# EAGLE schematic hoekdrive23-test-fixture (EAGLE 5.12)
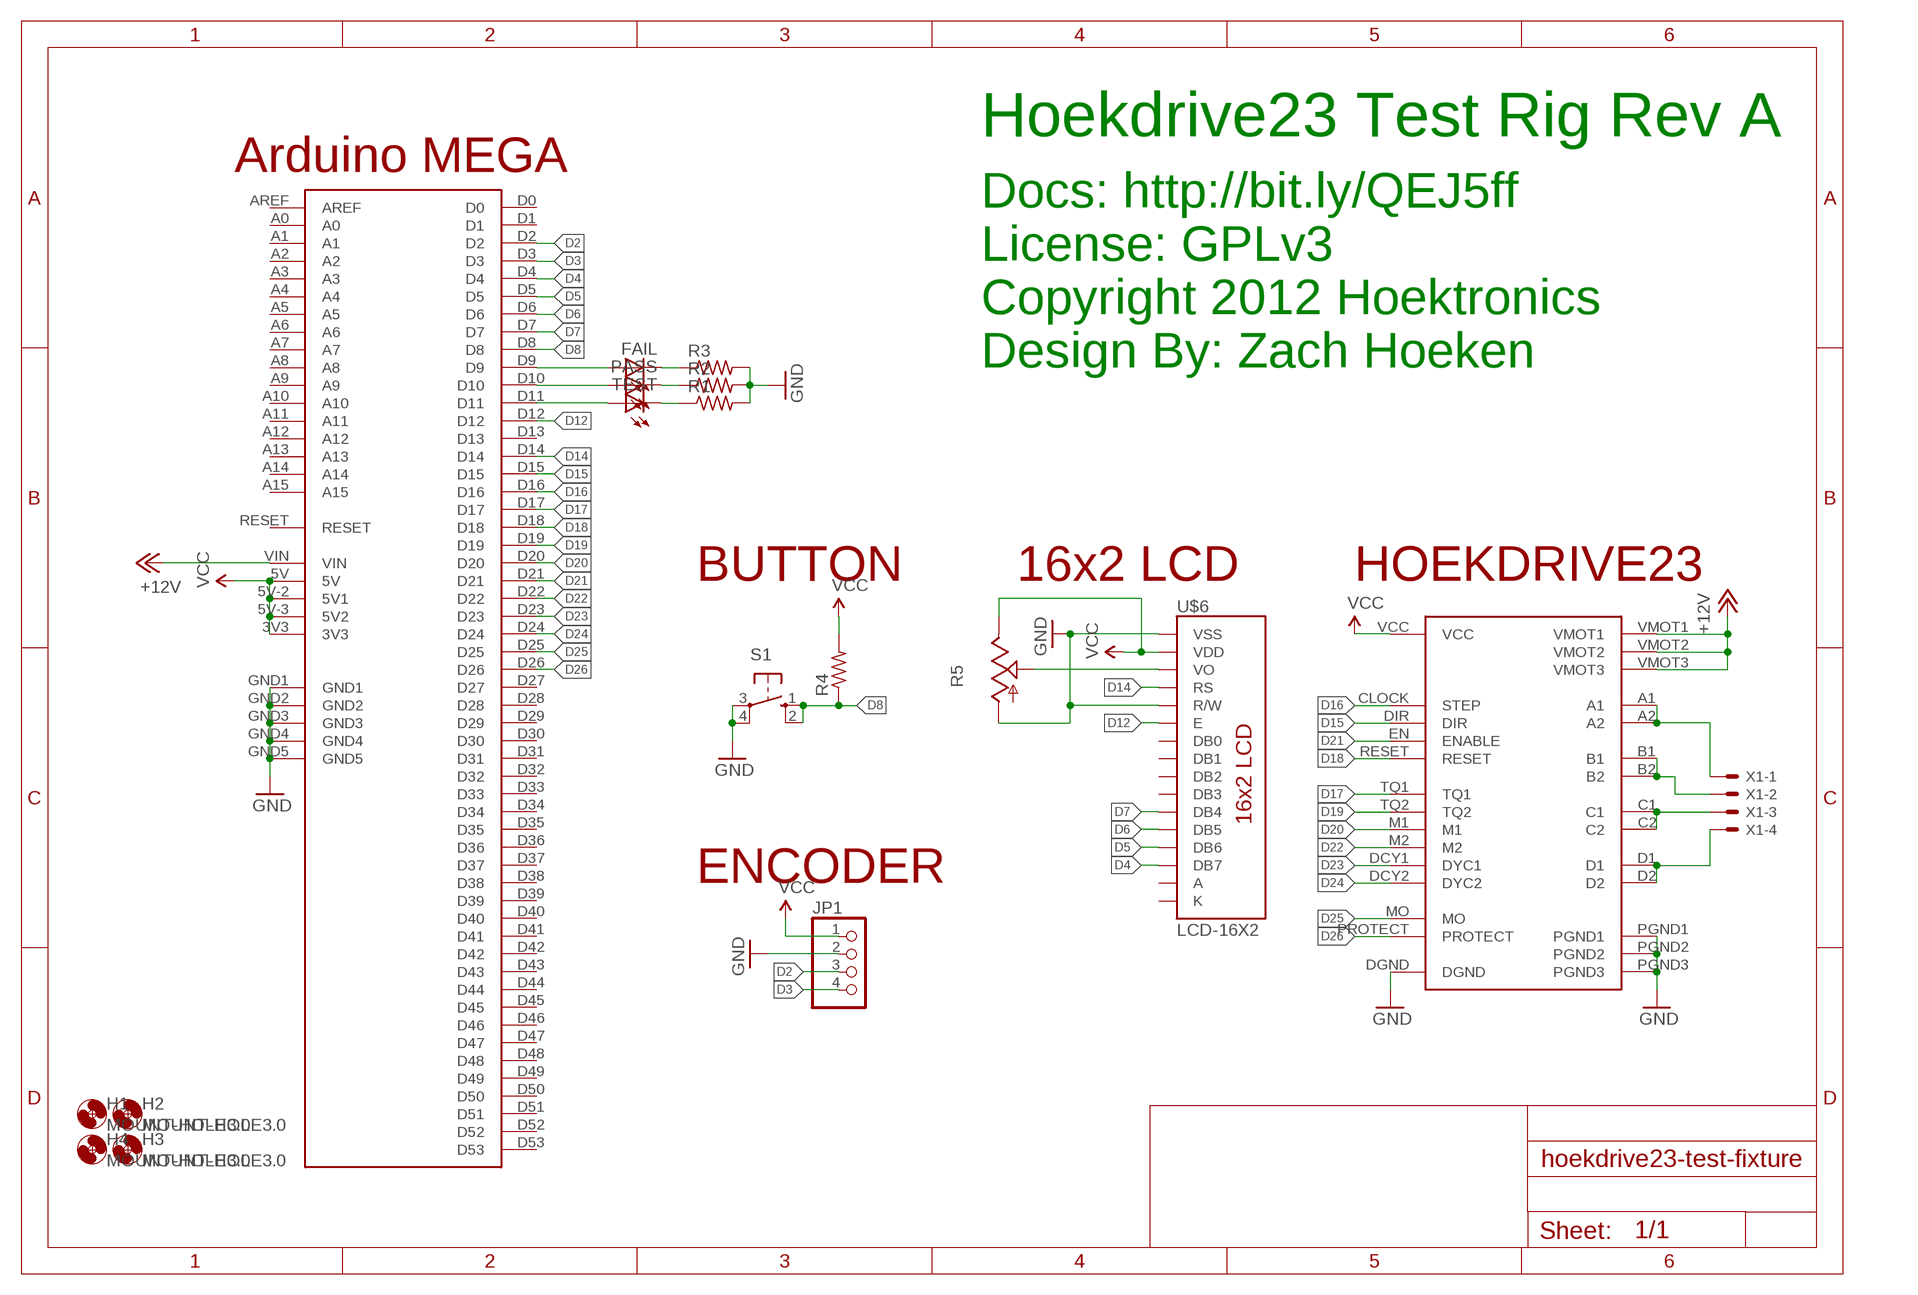
[diagram p0: schematic, sheet 1]

## Parts
FAIL  LED10MM  [LED10MM]
H1  MOUNT-HOLE3.0  [3,0]
H2  MOUNT-HOLE3.0  [3,0]
H3  MOUNT-HOLE3.0  [3,0]
H4  MOUNT-HOLE3.0  [3,0]
JP1  PINHD-1X4  [1X04]
M1  HOEKSTEP23  [HOEKSTEP23]
PASS  LED10MM  [LED10MM]
R1  R-US_0207/7  [0207/7]
R2  R-US_0207/7  [0207/7]
R3  R-US_0207/7  [0207/7]
R4  R-US_0207/7  [0207/7]
R5  TRIM_US-B25U  [B25U]
S1  40-XX  [B3F-40XX]
TEST  LED10MM  [LED10MM]
U$1  ARDUINO-MEGA  [ARDUINO-MEGA]
U$6  LCD-16X2  [LCD-16X2]
X1  KK-156-4  [KK-156-4]

## Nets
+12V: M1.VMOT1 M1.VMOT2 M1.VMOT3 U$1.VIN
D2: JP1.3 U$1.D2
D3: JP1.4 U$1.D3
D4: U$1.D4 U$6.14(DB7)
D5: U$1.D5 U$6.13(DB6)
D6: U$1.D6 U$6.12(DB5)
D7: U$1.D7 U$6.11(DB4)
D8: R4.1 S1.1(S) S1.2(S1) U$1.D8
D12: U$1.D12 U$6.6(E)
D14: U$1.D14 U$6.4(RS)
D15: M1.DIR U$1.D15
D16: M1.CLOCK(STEP) U$1.D16
D17: M1.TQ1 U$1.D17
D18: M1.RESET U$1.D18
D19: M1.TQ2 U$1.D19
D20: M1.M1 U$1.D20
D21: M1.EN(ENABLE) U$1.D21
D22: M1.M2 U$1.D22
D23: M1.DCY1(DYC1) U$1.D23
D24: M1.DCY2(DYC2) U$1.D24
D25: M1.MO U$1.D25
D26: M1.PROTECT U$1.D26
GND: JP1.2 M1.DGND M1.PGND1 M1.PGND2 M1.PGND3 R1.2 R2.2 R3.2 R5.A S1.3(P) S1.4(P1) U$1.GND1 U$1.GND2 U$1.GND3 U$1.GND4 U$1.GND5 U$6.1(VSS) U$6.5(R/W)
N$1: M1.B1 M1.B2 X1.2
N$2: M1.C1 M1.C2 X1.3
N$3: M1.A1 M1.A2 X1.1
N$5: FAIL.A U$1.D9
N$6: PASS.A U$1.D10
N$7: TEST.A U$1.D11
N$8: FAIL.C R3.1
N$9: PASS.C R2.1
N$10: R1.1 TEST.C
N$11: M1.D1 M1.D2 X1.4
N$19: R5.S U$6.3(VO)
VCC: JP1.1 M1.VCC R4.2 R5.E U$1.3V3 U$1.5V U$1.5V-2(5V1) U$1.5V-3(5V2) U$6.2(VDD)
Unconnected: U$1.A0 U$1.A1 U$1.A2 U$1.A3 U$1.A4 U$1.A5 U$1.A6 U$1.A7 U$1.A8 U$1.A9 U$1.A10 U$1.A11 U$1.A12 U$1.A13 U$1.A14 U$1.A15 U$1.AREF U$1.D0 U$1.D1 U$1.D13 U$1.D27 U$1.D28 U$1.D29 U$1.D30 U$1.D31 U$1.D32 U$1.D33 U$1.D34 U$1.D35 U$1.D36 U$1.D37 U$1.D38 U$1.D39 U$1.D40 U$1.D41 U$1.D42 U$1.D43 U$1.D44 U$1.D45 U$1.D46 U$1.D47 U$1.D48 U$1.D49 U$1.D50 U$1.D51 U$1.D52 U$1.D53 U$1.RESET U$6.7(DB0) U$6.8(DB1) U$6.9(DB2) U$6.10(DB3)

## Notes on the sheet
- Hoekdrive23 Test Rig Rev A
- Arduino MEGA
- Docs: http://bit.ly/QEJ5ff
- License: GPLv3
- Copyright 2012 Hoektronics
- Design By: Zach Hoeken
- BUTTON | 16x2 LCD | HOEKDRIVE23
- ENCODER

## Power pins joined to a net without a drawn wire
A: U$6.15(A)
K: U$6.16(K)

## Library data of the parts
FAIL PASS TEST = SparkFun:LED: LEDs Standard schematic elements and footprints for 5mm, 3mm, 1206, and 0603 sized LEDs. 5mm - Spark Fun Electronics SKU : COM-00529 (and others)
H1-H4 = holes:MOUNT-HOLE: MOUNTING HOLE with drill center marker
JP1 = pinhead:PINHD-1X4: PIN HEADER
M1 = Hoektronics:HOEKSTEP23
R1-R4 = resistor:R-US_: RESISTOR, American symbol
R5 = pot:TRIM_US-: POTENTIOMETER
S1 = switch-omron:40-XX: OMRON SWITCH; MF: OMRON COMPONENTS USA; MPN: B3F-4000; OC_FARNELL: 176434; OC_NEWARK: 36K3105
U$1 = MakerBot:ARDUINO-MEGA
U$6 = SparkFun:LCD-16X2
X1 = con-molex:KK-156-4: KK 156 HEADER Source: http://www.molex.com/pdm_docs/sd/026604100_sd.pdf; OC_FARNELL: unknown; OC_NEWARK: unknown

## Net classes
0 default: width 0.381 mm, clearance 0.381 mm